# EAGLE design phono (EAGLE 7.6.0)
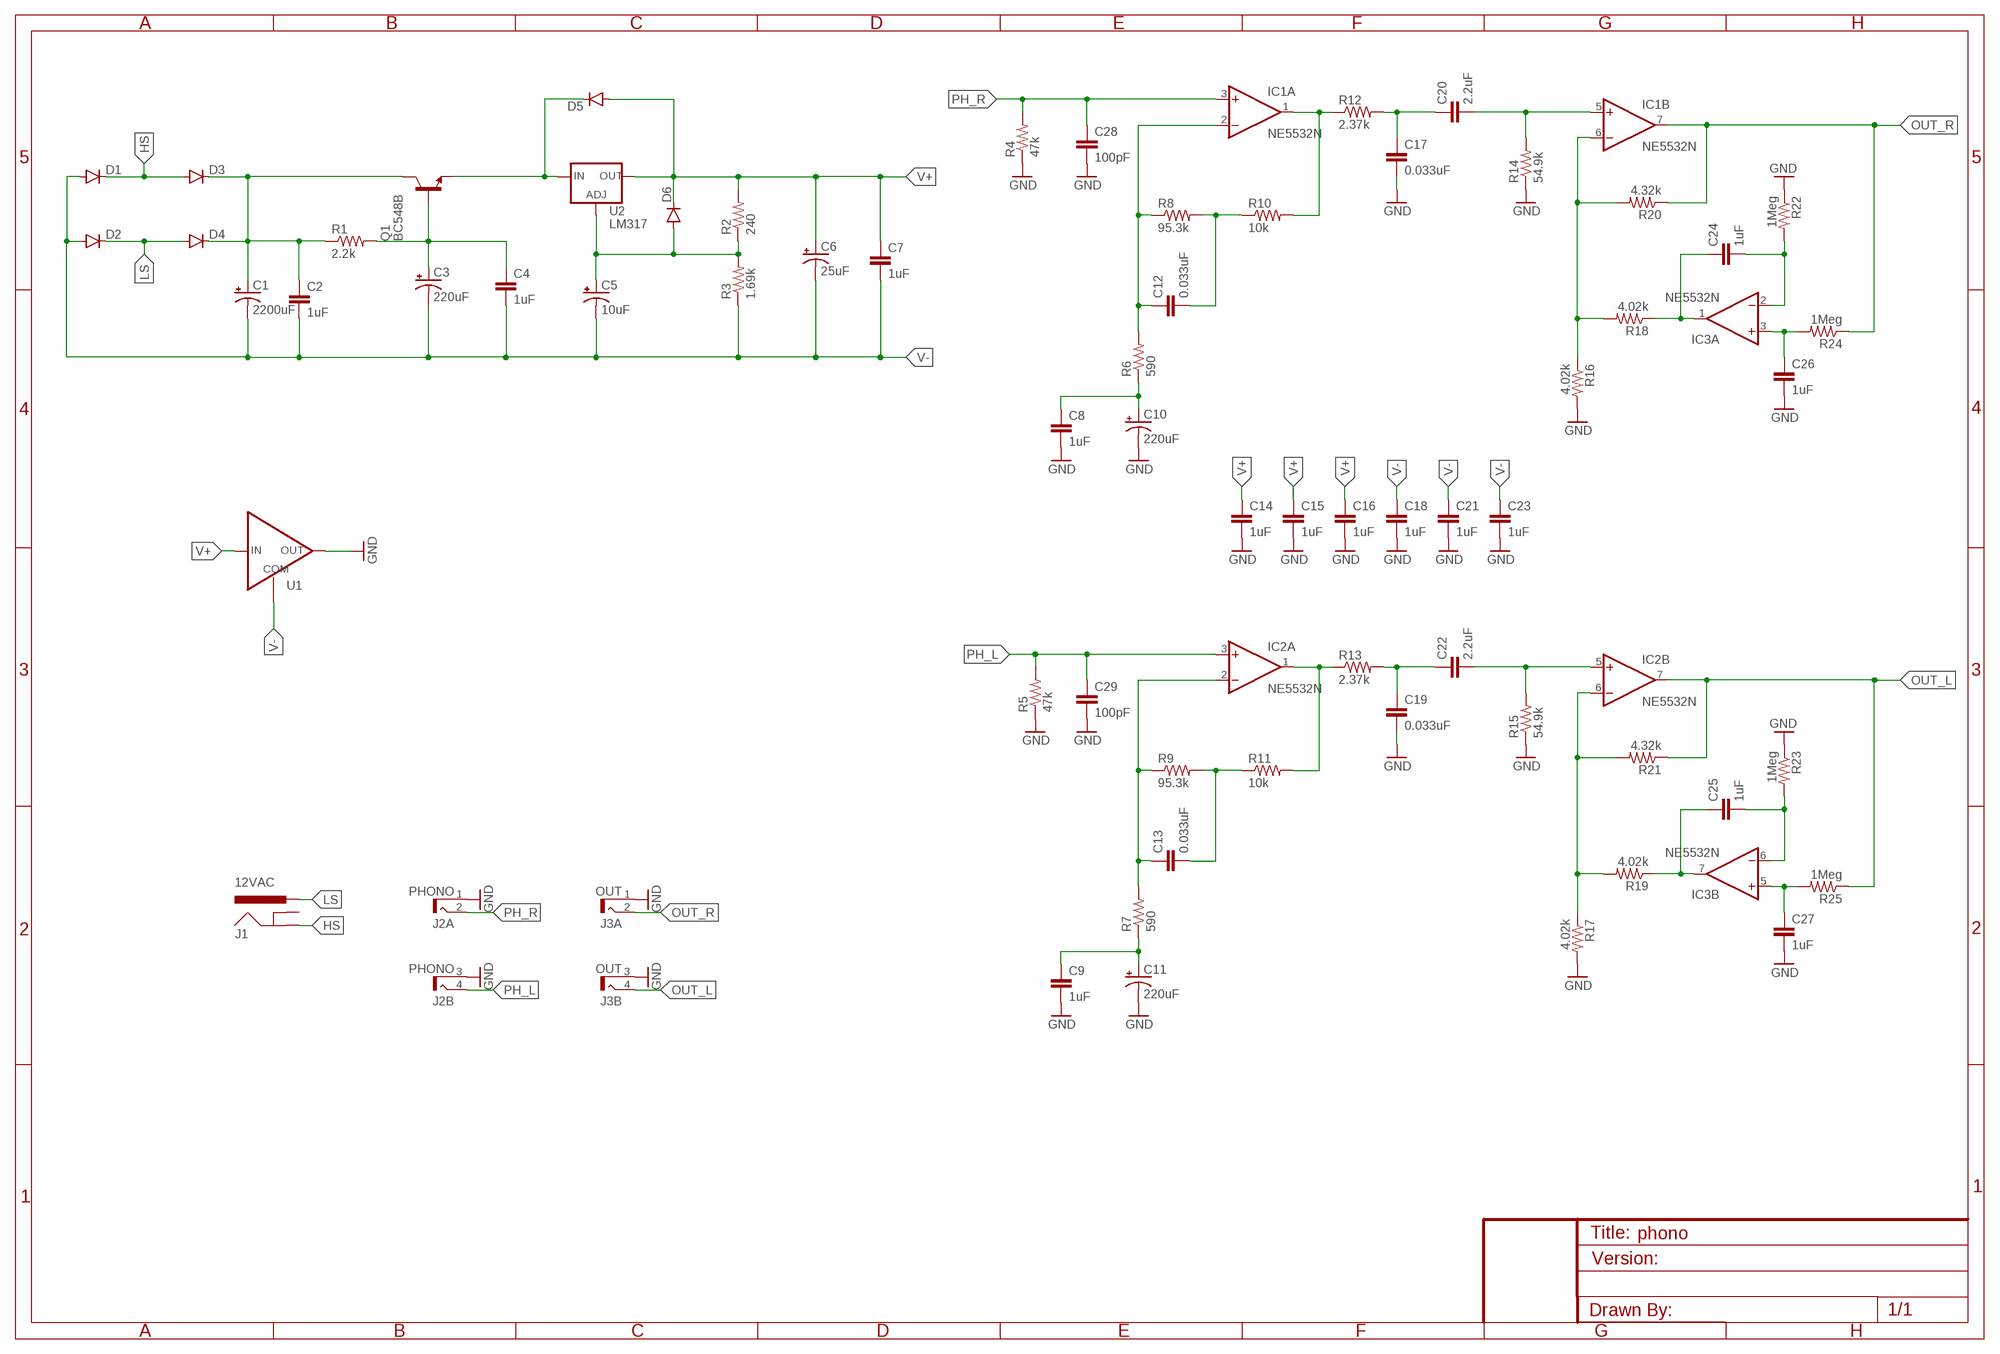
[diagram p0: schematic, sheet 1]

## Parts
C1  2200uF  CAP_POLPTH4  [CPOL-RADIAL-1000UF-25V]
C2  1uF  CAPPTH  [CAP-PTH-SMALL]
C3  220uF  CPOL-USE3.5-8  [E3,5-8]
C4  1uF  CAPPTH  [CAP-PTH-SMALL]
C5  10uF  CAP_POLPTH2  [CPOL-RADIAL-10UF-25V]
C6  25uF  CAP_POLPTH2  [CPOL-RADIAL-10UF-25V]
C7  1uF  CAPPTH  [CAP-PTH-SMALL]
C8  1uF  CAPPTH  [CAP-PTH-SMALL]
C9  1uF  CAPPTH  [CAP-PTH-SMALL]
C10  220uF  CPOL-USE3.5-8  [E3,5-8]
C11  220uF  CPOL-USE3.5-8  [E3,5-8]
C12  0.033uF  C5/7.2  [C5B7.2]
C13  0.033uF  C5/7.2  [C5B7.2]
C14  1uF  CAPPTH  [CAP-PTH-SMALL]
C15  1uF  CAPPTH  [CAP-PTH-SMALL]
C16  1uF  CAPPTH  [CAP-PTH-SMALL]
C17  0.033uF  C5/7.2  [C5B7.2]
C18  1uF  CAPPTH  [CAP-PTH-SMALL]
C19  0.033uF  C5/7.2  [C5B7.2]
C20  2.2uF  C5/7.2  [C5B7.2]
C21  1uF  CAPPTH  [CAP-PTH-SMALL]
C22  2.2uF  C5/7.2  [C5B7.2]
C23  1uF  CAPPTH  [CAP-PTH-SMALL]
C24  1uF  C5/5.5  [C5B5.5]
C25  1uF  C5/5.5  [C5B5.5]
C26  1uF  C5/5.5  [C5B5.5]
C27  1uF  C5/5.5  [C5B5.5]
C28  100pF  C5/4.5  [C5B4.5]
C29  100pF  C5/4.5  [C5B4.5]
D1  DIODEPTH  [DIODE-1N4001]
D2  DIODEPTH  [DIODE-1N4001]
D3  DIODEPTH  [DIODE-1N4001]
D4  DIODEPTH  [DIODE-1N4001]
D5  DIODEPTH  [DIODE-1N4001]
D6  DIODEPTH  [DIODE-1N4001]
IC1  NE5532N  [DIL08]
IC2  NE5532N  [DIL08]
IC3  NE5532N  [DIL08]
J1  12VAC  POWER_JACKPTH  [POWER_JACK_PTH]
J2  PHONO  RCJ-21XX  [RCJ-21]
J3  OUT  RCJ-21XX  [RCJ-21]
Q1  BC548B  [TO92-EBC]
R1  2.2k  RESISTORPTH-1/4W  [AXIAL-0.4]
R2  240  RESISTORPTH-1/4W  [AXIAL-0.4]
R3  1.69k  RESISTORPTH-1/4W  [AXIAL-0.4]
R4  47k  RESISTORPTH-1/4W  [AXIAL-0.4]
R5  47k  RESISTORPTH-1/4W  [AXIAL-0.4]
R6  590  RESISTORPTH-1/4W  [AXIAL-0.4]
R7  590  RESISTORPTH-1/4W  [AXIAL-0.4]
R8  95.3k  RESISTORPTH-1/4W  [AXIAL-0.4]
R9  95.3k  RESISTORPTH-1/4W  [AXIAL-0.4]
R10  10k  RESISTORPTH-1/4W  [AXIAL-0.4]
R11  10k  RESISTORPTH-1/4W  [AXIAL-0.4]
R12  2.37k  RESISTORPTH-1/4W  [AXIAL-0.4]
R13  2.37k  RESISTORPTH-1/4W  [AXIAL-0.4]
R14  54.9k  RESISTORPTH-1/4W  [AXIAL-0.4]
R15  54.9k  RESISTORPTH-1/4W  [AXIAL-0.4]
R16  4.02k  RESISTORPTH-1/4W  [AXIAL-0.4]
R17  4.02k  RESISTORPTH-1/4W  [AXIAL-0.4]
R18  4.02k  RESISTORPTH-1/4W  [AXIAL-0.4]
R19  4.02k  RESISTORPTH-1/4W  [AXIAL-0.4]
R20  4.32k  RESISTORPTH-1/4W  [AXIAL-0.4]
R21  4.32k  RESISTORPTH-1/4W  [AXIAL-0.4]
R22  1Meg  RESISTORPTH-1/4W  [AXIAL-0.4]
R23  1Meg  RESISTORPTH-1/4W  [AXIAL-0.4]
R24  1Meg  RESISTORPTH-1/4W  [AXIAL-0.4]
R25  1Meg  RESISTORPTH-1/4W  [AXIAL-0.4]
U1  TLE2426-3  [TO92-BENT]
U2  LM317  V_REG_317DPACK  [V-REG_DPACK]

## Nets
FB2_L: IC2.6(B:-IN) R17.P$1 R19.P$2 R21.P$2
FB2_R: IC1.6(B:-IN) R16.P$1 R18.P$2 R20.P$2
FB_L: C13.1 IC2.2(A:-IN) R7.P$2 R9.P$1
FB_R: C12.1 IC1.2(A:-IN) R6.P$2 R8.P$1
GND: C8.2 C9.2 C10.- C11.- C14.2 C15.2 C16.2 C17.2 C18.2 C19.2 C21.2 C23.2 C26.2 C27.2 C28.2 C29.2 J2.1(A:S) J2.3(B:S) J3.1(A:S) J3.3(B:S) R4.P$1 R5.P$1 R14.P$1 R15.P$1 R16.P$2 R17.P$2 R22.P$1 R23.P$1 U1.1(OUT)
HS: D1.C D3.A J1.GND
LS: D2.C D4.A J1.PWR
N$1: IC1.1(A:OUT) R10.P$2 R12.P$1
N$2: C12.2 R8.P$2 R10.P$1
N$3: D5.C Q1.E U2.3(IN)
N$4: C17.1 C20.1 R12.P$2
N$5: C20.2 IC1.5(B:+IN) R14.P$2
N$6: C8.1 C10.+ R6.P$1
N$7: IC2.1(A:OUT) R11.P$2 R13.P$1
N$8: C24.1 IC3.1(A:OUT) R18.P$1
N$9: C3.+ C4.1 Q1.B R1.P$2
N$10: C24.2 IC3.2(A:-IN) R22.P$2
N$11: C26.1 IC3.3(A:+IN) R24.P$2
N$12: C13.2 R9.P$2 R11.P$1
N$13: C9.1 C11.+ R7.P$1
N$14: C19.1 C22.1 R13.P$2
N$15: C22.2 IC2.5(B:+IN) R15.P$2
N$16: C25.1 IC3.7(B:OUT) R19.P$1
N$18: C25.2 IC3.6(B:-IN) R23.P$2
N$19: C27.1 IC3.5(B:+IN) R25.P$2
N$21: C5.1(+) D6.A R2.P$1 R3.P$2 U2.1(ADJ)
N$22: C1.+ C2.1 D3.C D4.C Q1.C R1.P$1
OUT_L: IC2.7(B:OUT) J3.4(B:T) R21.P$1 R25.P$1
OUT_R: IC1.7(B:OUT) J3.2(A:T) R20.P$1 R24.P$1
PH_L: C29.1 IC2.3(A:+IN) J2.4(B:T) R5.P$2
PH_R: C28.1 IC1.3(A:+IN) J2.2(A:T) R4.P$2
V+: C6.1(+) C7.1 C14.1 C15.1 C16.1 D5.A D6.C R2.P$2 U1.3(IN) U2.4(OUT)
V-: C1.- C2.2 C3.- C4.2 C5.2(-) C6.2(-) C7.2 C18.1 C21.1 C23.1 D1.A D2.A R3.P$1 U1.2(COM)
Unconnected: J1.GNDBREAK

## Power pins joined to a net without a drawn wire
V+: IC1.8(P:V+) IC2.8(P:V+) IC3.8(P:V+)
V-: IC1.4(P:V-) IC2.4(P:V-) IC3.4(P:V-)

## Library data of the parts
C1 C5 C6 = SparkFun-Capacitors:CAP_POL: Capacitor Polarized These are standard SMD and PTH capacitors. Normally 10uF, 47uF, and 100uF in electrolytic and tantalum varieties. Always verify the external diameter of the through hole cap, it varies with capacity, voltage, and manufacturer. The EIA devices should be standard.
C2 C4 C7-C9 C14-C16 C18 C21 C23 = SparkFun-Capacitors:CAP: Capacitor Standard 0603 ceramic capacitor, and 0.1" leaded capacitor.
C3 C10 C11 = rcl:CPOL-US: POLARIZED CAPACITOR, American symbol
C12 C13 C17 C19 = capacitor-wima:C: CAPACITOR naming: grid - package width; MOUSER_ID: 505-FKP20.033/63/2.5
C20 C22 = capacitor-wima:C: CAPACITOR naming: grid - package width; MOUSER_ID: 505-MKS22.2/63/5
C24-C29 = capacitor-wima:C: CAPACITOR naming: grid - package width
D1-D6 = SparkFun-DiscreteSemi:DIODE: Diode These are standard reverse protection diodes and small signal diodes. SMA package can handle up to about 1A. SOD-323 can handle about 200mA. What the SOD-323 package when ordering, there are some mfgs out there that are 5-pin packages.
IC1-IC3 = linear:NE5532: AUDIO AMPLIFIER
J1 = SparkFun-Connectors:POWER_JACK: Power Jack This is the standard 5.5mm barrel jack for power. The PTH is the most common, proven, reliable, footprint. The Slot footprint only works if the mill layer is transmitted to the PCB fab house so be warned. Mating wall wart : TOL-00298 (and others); PROD_ID: CONN-08197
J2 J3 = my:RCJ-21XX: Dual RCA Jack
Q1 = transistor-npn:BC548*: NPN Transistor
R1-R25 = SparkFun-Resistors:RESISTOR: Resistor Basic schematic elements and footprints for 0603, 1206, and PTH resistors.
U1 = my:TLE2426-3
U2 = SparkFun-PowerIC:V_REG_317: Voltage Regulator Standard LM317 adjustable voltage regulator. AOI (Adjust Output Input). Google 'LM317 Calculator' for easy to use app to get the two resistor values needed. 240/720 for 5V output. 240/390 for 3.3V output. Spark Fun Electronics SKU : COM-00527; PROD_ID: IC-09888

## Board
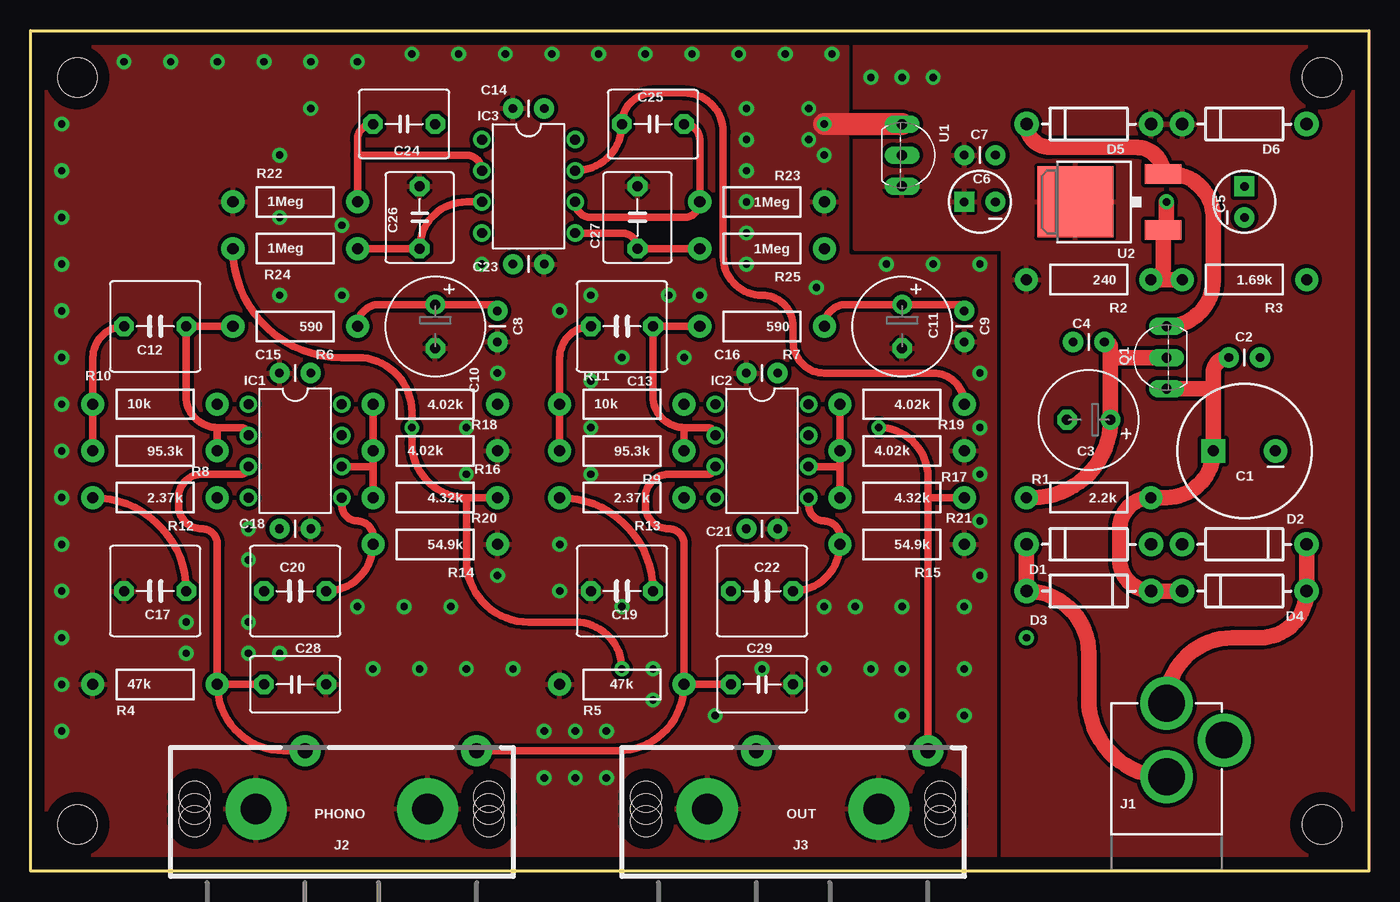
[diagram p1: board, top side]
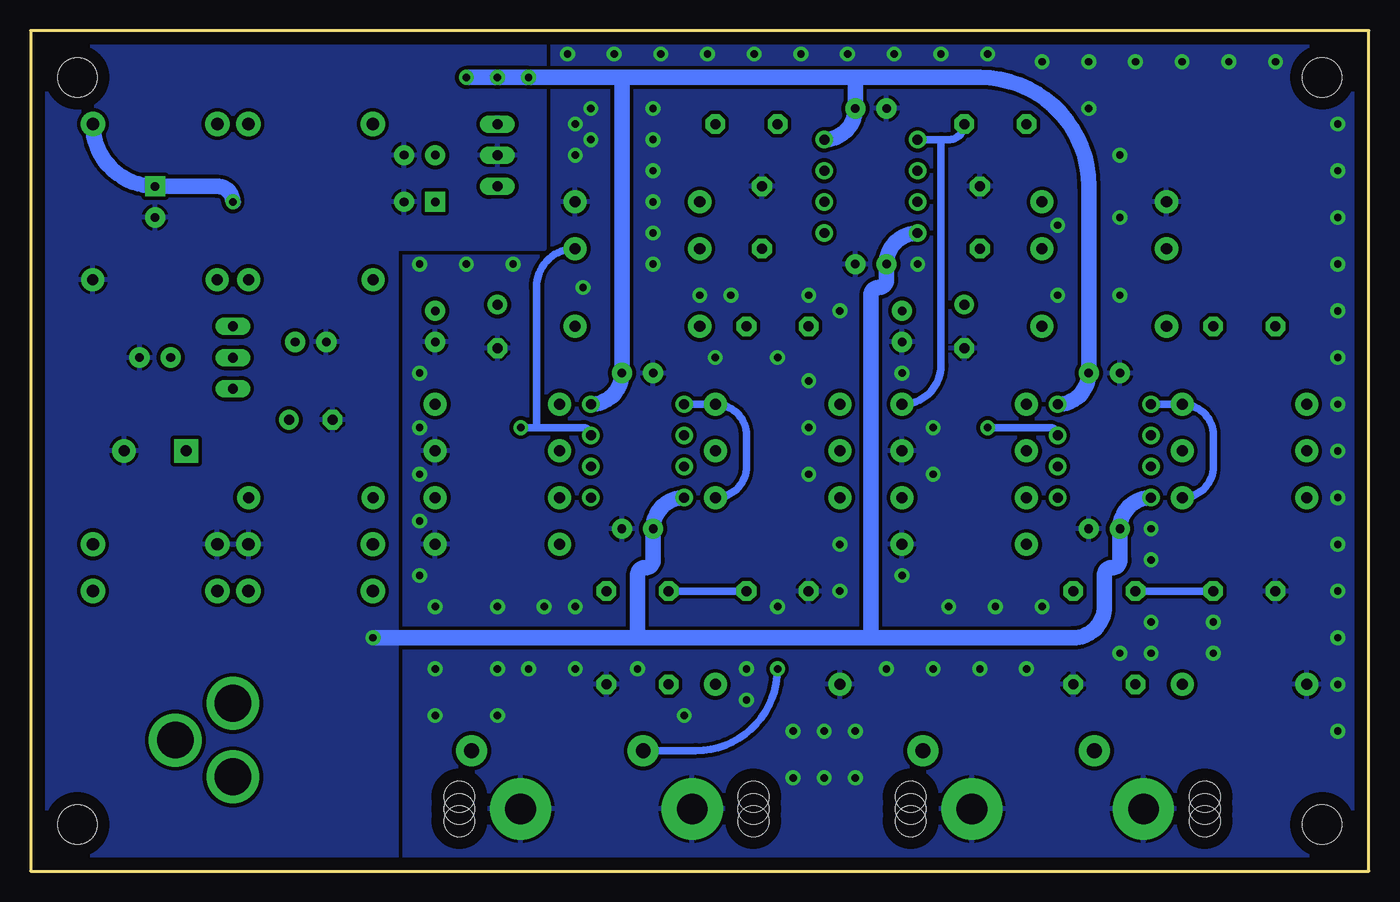
[diagram p2: board, bottom side, seen from below]

Size 109.22 x 68.58 mm. Coordinates in mm from the lower left corner, seen from the top.
Outline: 0,68.58 109.22,68.58 109.22,0 0,0 0,68.58
Copper layers (1*16): Top 0.035mm / dielectric 1.5mm / Bottom 0.035mm
Design rules "default *": minimum track width 12mil, minimum drill 22mil, track to track 12mil, track to pad 12mil, pad to pad 12mil, via to via 12mil, smd to smd 0mil, copper to edge 40mil, drill to drill 12mil, minimum pad ring 12mil, minimum via ring 12mil, stop-mask expansion 4mil, vias tented up to drill 0mil, thermal gap 10mil
Holes 3.2 mm at 3.81,3.81 105.41,3.81 105.41,64.77 3.81,64.77

### Footprints (pad centres in the part's own frame; a part is rotated, then mirrored left to right if it is on the bottom)
CPOL-RADIAL-1000UF-25V = drill 0.9 pad 1.93 square: + 2.54,0 | drill 0.9 pad 1.93: - -2.54,0
CAP-PTH-SMALL = drill 0.7 pad 1.651: 1 0,0; 2 2.54,0
E3,5-8 = drill 0.813 pad 1.6: + -1.778,0 | drill 0.813 pad 1.6 octagon: - 1.778,0
CPOL-RADIAL-10UF-25V = drill 0.7 pad 1.651 square: 1 1.27,0 | drill 0.7 pad 1.651: 2 -1.27,0
C5B7.2 = drill 0.813 pad 1.6 octagon: 1 -2.54,0; 2 2.54,0
C5B5.5 = drill 0.813 pad 1.6 octagon: 1 -2.54,0; 2 2.54,0
C5B4.5 = drill 0.813 pad 1.6 octagon: 1 -2.54,0; 2 2.54,0
DIODE-1N4001 = drill 1 pad 1.981: A -5.08,0; C 5.08,0
DIL08 = drill 0.813 pad 1.27: 1 -3.81,-3.81; 2 -1.27,-3.81; 3 1.27,-3.81; 4 3.81,-3.81; 5 3.81,3.81; 6 1.27,3.81; 7 -1.27,3.81; 8 -3.81,3.81
POWER_JACK_PTH = drill 2.997 pad 4.318: GND 0,7.7; GNDBREAK 4.7,10.7; PWR 0,13.7
RCJ-21 = drill 2.5 pad 5: 1 7,0; 3 -7,0 | drill 1.2 pad 2.54: 2 3,-4.75; 4 -11,-4.75 | hole 2.5: -12,1; -12,-1; -12,0; 12,1; 12,-1; 12,0
TO92-EBC = drill 0.813 long: B 0,-1.27; C -2.54,-1.27; E 2.54,-1.27
AXIAL-0.4 = drill 0.9 pad 1.88: P$1 -5.08,0; P$2 5.08,0
TO92-BENT = drill 0.813 long: 1 -2.54,-1.27; 2 0,-1.27; 3 2.54,-1.27
V-REG_DPACK = smd 1.6 x 3: 1 -2.28,-4.8; 3 2.28,-4.8 | smd 5.8 x 6.2: 4 0,2.38

### Placement (x,y rotation side)
C1  99.06,34.29 180 top
C2  97.79,41.91 0 top
C3  86.36,36.83 180 top
C4  87.63,43.18 180 top
C5  99.06,54.61 90 top
C6  77.47,54.61 180 top
C7  76.2,58.42 0 top
C8  38.1,45.72 270 top
C9  76.2,45.72 270 top
C10  33.02,44.45 270 top
C11  71.12,44.45 270 top
C12  10.16,44.45 180 top
C13  48.26,44.45 180 top
C14  41.91,62.23 180 top
C15  22.86,40.64 180 top
C16  60.96,40.64 180 top
C17  10.16,22.86 180 top
C18  20.32,27.94 0 top
C19  48.26,22.86 180 top
C20  21.59,22.86 0 top
C21  58.42,27.94 0 top
C22  59.69,22.86 0 top
C23  39.37,49.53 0 top
C24  30.48,60.96 180 top
C25  50.8,60.96 0 top
C26  31.75,53.34 90 top
C27  49.53,53.34 90 top
C28  21.59,15.24 0 top
C29  59.69,15.24 0 top
D1  86.36,26.67 180 top
D2  99.06,26.67 0 top
D3  86.36,22.86 0 top
D4  99.06,22.86 180 top
D5  86.36,60.96 180 top
D6  99.06,60.96 180 top
IC1  21.59,34.29 270 top
IC2  59.69,34.29 270 top
IC3  40.64,55.88 270 top
J1  92.71,0 0 top
J2  25.4,5.08 180 top
J3  62.23,5.08 180 top
Q1  91.44,41.91 90 top
R1  86.36,30.48 180 top
R2  86.36,48.26 180 top
R3  99.06,48.26 180 top
R4  10.16,15.24 0 top
R5  48.26,15.24 0 top
R6  21.59,44.45 180 top
R7  59.69,44.45 180 top
R8  10.16,34.29 180 top
R9  48.26,34.29 180 top
R10  10.16,38.1 0 top
R11  48.26,38.1 0 top
R12  10.16,30.48 180 top
R13  48.26,30.48 180 top
R14  33.02,26.67 180 top
R15  71.12,26.67 180 top
R16  33.02,34.29 0 top
R17  71.12,34.29 0 top
R18  33.02,38.1 180 top
R19  71.12,38.1 180 top
R20  33.02,30.48 180 top
R21  71.12,30.48 180 top
R22  21.59,54.61 0 top
R23  59.69,54.61 180 top
R24  21.59,50.8 0 top
R25  59.69,50.8 180 top
U1  72.39,58.42 270 top
U2  87.63,54.61 90 top

### Tracks (layer width: path | path; a pad name or v marks a point on that pad's centre or on a via)
FB2_L
  Top 0.61: R21.P$2 66.04,33.02 | 66.04,33.02 R17.P$1 R19.P$2 | IC2.6 66.04,33.02
FB2_R
  Top 0.61: R20.P$2 27.94,33.02 | 27.94,33.02 R16.P$1 R18.P$2 | IC1.6 27.94,33.02
FB_L
  Top 0.61: R7.P$2 C13.1 50.8,38.73 arc90 53.34,36.2 | 53.34,36.2 55.25,36.2 arc-90 IC2.2 | R9.P$1 53.34,36.2
FB_R
  Top 0.61: R6.P$2 C12.1 12.7,38.73 arc90 15.24,36.2 | 15.24,36.2 17.14,36.2 arc-90 IC1.2 | R8.P$1 15.24,36.2
GND  (via drill 0.6)
  Top 1.778: U1.1 v64.77,60.96
  other vias: 2.54,11.43 2.54,15.24 2.54,19.05 2.54,22.86 2.54,26.67 2.54,30.48 2.54,34.29 2.54,38.1 2.54,41.91 2.54,45.72 2.54,49.53 2.54,53.34 2.54,57.15 2.54,60.96 7.62,66.04 11.43,66.04 15.24,66.04 19.05,66.04 22.86,66.04 26.67,66.04 64.77,58.42 63.5,59.69 63.5,62.23 31.11,66.67 34.92,66.67 38.73,66.67 42.55,66.67 46.36,66.67 50.16,66.67 53.98,66.67 57.79,66.67 61.59,66.67 65.41,66.67 69.85,49.53 73.66,49.53 77.47,49.53 77.47,40.64 77.47,36.2 77.47,32.38 77.47,28.57 77.47,24.13 76.2,21.59 71.12,21.59 67.31,21.59 64.77,21.59 48.26,21.59 43.18,22.86 43.18,26.67 43.18,45.72 38.1,40.64 38.1,24.13 45.72,32.38 45.72,36.2 45.72,40.01 35.56,36.2 35.56,32.38 34.29,21.59 30.48,21.59 26.67,21.59 17.78,27.94 17.78,25.4 20.32,17.78 27.94,16.51 31.75,16.51 35.56,16.51 39.37,16.51 64.77,16.51 68.58,16.51 76.2,16.51 22.86,62.23 20.32,58.42 20.32,53.34 20.32,46.99 25.4,46.99 25.4,52.71 64.14,47.62 58.42,62.23 58.42,59.69 58.42,57.15 58.42,54.61 58.42,52.07 58.42,49.53 54.61,46.99 45.72,46.99 52.07,46.99 53.34,41.91 48.26,41.91 36.83,49.53 50.8,16.51 59.69,16.51 50.8,13.97 41.91,7.62 44.45,7.62 46.99,7.62 41.91,11.43 44.45,11.43 46.99,11.43 71.12,16.51 71.12,12.7 76.2,12.7 55.88,12.7 12.7,17.78 12.7,20.32 17.78,17.78 17.78,20.32
  pour Top (isolate 0.305, rank 2): 0,68.58 109.22,68.58 109.22,0 0,0
  pour Bottom (isolate 0.305, rank 2): 0,68.58 109.22,68.58 109.22,0 0,0
HS
  Top 1.27: D1.C D3.A arc-90 86.36,17.78 86.36,14.05 arc90 J1.GND
LS
  Top 1.27: D2.C D4.A arc-90 100.33,19.05 98.06,19.05 arc90 J1.PWR
N$1
  Bottom 0.61: R12.P$1 arc-90 12.7,33.02 12.7,35.56 arc-90 R10.P$2 IC1.1
N$2
  Top 0.61: R8.P$2 R10.P$1 5.08,41.91 arc-90 C12.2
N$3
  Top 0.813: 92.97,56.89 U2.3
  Top 1.27: U2.3 arc90 90.27,59.05 83.19,59.05 arc-90 D5.C | Q1.E arc90 96.52,48.26 96.52,53.34 arc90 92.97,56.89
N$4
  Top 0.61: C17.1 arc90 R12.P$2
  Bottom 0.61: C17.1 C20.1
N$5
  Top 0.61: C20.2 arc90 R14.P$2 27.94,27.3 arc90 26.67,28.57 arc-90 25.4,29.84 IC1.5
N$6
  Top 0.61: R6.P$1 arc-90 28.45,46.23 C10.+ 37.59,46.23 arc-90 C8.1
N$7
  Bottom 0.61: R13.P$1 arc-90 50.8,33.02 50.8,35.56 arc-90 R11.P$2 IC2.1
N$8
  Bottom 0.61: R18.P$1 arc-90 34.92,41.28 34.92,59.69 | IC3.1 34.92,59.69 | 34.92,59.69 34.29,59.69 arc-90 C24.1
N$9
  Top 0.813: R1.P$2 81.79,30.48
  Top 1.27: 81.79,30.48 arc90 C3.+ 88.14,41.91 | 88.14,41.91 88.14,42.67 arc90 C4.1 | Q1.B 88.14,41.91
N$10
  Top 0.61: C24.2 arc90 26.67,59.69 26.67,58.42 | 26.67,58.42 R22.P$2 | IC3.2 arc90 35.56,58.42 26.67,58.42
N$11
  Top 0.61: IC3.3 35.56,54.61 arc90 C26.1 R24.P$2
N$12
  Top 0.61: R9.P$2 R11.P$1 43.18,41.91 arc-90 C13.2
N$13
  Top 0.61: C9.1 arc90 75.69,46.23 C11.+ 66.55,46.23 arc90 R7.P$1
N$14
  Top 0.61: C19.1 arc90 R13.P$2
  Bottom 0.61: C19.1 C22.1
N$15
  Top 0.61: C22.2 arc90 R15.P$2 66.04,27.3 arc90 64.77,28.57 arc-90 63.5,29.84 IC2.5
N$16
  Top 0.61: IC3.7 arc90 C25.1 arc-90 50.8,63.5 53.34,63.5 arc-90 56.52,60.33 56.52,50.16 arc90 59.69,46.99 arc-90 62.23,44.45 62.23,43.18 arc90 64.77,40.64 73.66,40.64 arc-90 R19.P$1
N$18
  Top 0.61: C25.2 arc-90 54.61,59.69 R23.P$2 arc-90 53.34,53.34 45.72,53.34 arc-90 IC3.6
N$19
  Top 0.61: IC3.5 48.26,52.07 arc-90 C27.1 R25.P$2
N$21  (via drill 0.6)
  Top 0.813: U2.1 arc90 92.71,52.61
  Top 1.27: R3.P$2 R2.P$1 arc90 92.43,49.25 U2.1 | 92.71,52.61 v92.71,54.61
  Bottom 1.27: v92.71,54.61 arc-90 93.98,55.88 C5.1 arc90 D6.A
N$22
  Top 1.27: D4.C D3.C arc-90 88.9,25.4 88.9,27.94 arc-90 R1.P$1 92.71,30.48 arc90 C1.+ 96.52,39.37 | 96.52,39.37 96.52,40.64 arc-90 C2.1 | Q1.C 96.52,39.37
OUT_L  (via drill 0.6)
  Top 0.61: J3.4 73.23,30.48 | R21.P$1 73.23,30.48 | 73.23,30.48 73.23,32.18 arc90 v69.22,36.2
  Bottom 0.61: v69.22,36.2 67.95,36.2 | 67.95,36.2 64.14,36.2 arc90 IC2.7 | R25.P$1 arc-90 67.95,47.62 67.95,36.2
OUT_R  (via drill 0.6)
  Top 0.61: 35.56,30.48 35.56,25.4 arc90 40.64,20.32 44.45,20.32 arc-90 v48.26,16.51 | R20.P$1 35.56,30.48 | R24.P$1 arc90 25.4,41.91 26.67,41.91 arc-90 31.11,37.47 v31.11,36.2 31.11,34.92 arc90 35.56,30.48
  Bottom 0.61: v31.11,36.2 26.04,36.2 arc90 IC1.7 | J3.2 54.94,9.83 arc-90 v48.26,16.51
PH_L
  Top 0.61: R5.P$2 53.34,26.67 arc90 52.07,27.94 arc-90 50.16,29.84 50.16,30.48 arc-90 52.07,32.38 55.25,32.38 arc90 IC2.3 | J2.4 47.93,9.83 arc90 R5.P$2 | R5.P$2 C29.1
PH_R
  Top 0.61: R4.P$2 15.24,26.67 arc90 13.97,27.94 arc-90 12.07,29.84 12.07,30.48 arc-90 13.97,32.38 17.14,32.38 arc90 IC1.3 | R4.P$2 arc90 20.65,9.83 J2.2 | C28.1 R4.P$2
V+  (via drill 0.6)
  Bottom 1.27: 60.96,64.77 v68.58,64.77 v71.12,64.77 v73.66,64.77 | 60.96,64.77 41.91,64.77 | 41.91,64.77 31.75,64.77 arc90 22.86,55.88 C15.1 arc90 IC1.8 | 41.91,64.77 C14.1 arc90 IC3.8 | 60.96,64.77 C16.1 arc90 IC2.8
  pour Top (isolate 0.305): 109.22,0 79.38,0 79.38,50.8 67.31,50.8 67.31,68.58 109.22,68.58
V-  (via drill 0.6)
  Bottom 1.27: v81.28,19.05 59.69,19.05 | 59.69,19.05 40.64,19.05 | 40.64,19.05 24.13,19.05 arc-90 21.59,21.59 21.59,24.13 arc90 20.95,24.76 arc-90 20.32,25.4 C18.1 arc90 IC1.4 | 59.69,19.05 59.69,24.13 arc90 59.05,24.76 arc-90 58.42,25.4 C21.1 arc90 IC2.4 | 40.64,19.05 40.64,46.99 arc90 40.01,47.62 arc-90 39.37,48.26 C23.1 arc90 IC3.4
  pour Bottom (isolate 0.305): 67.31,68.58 67.31,50.8 79.38,50.8 79.38,0 109.22,0 109.22,68.58